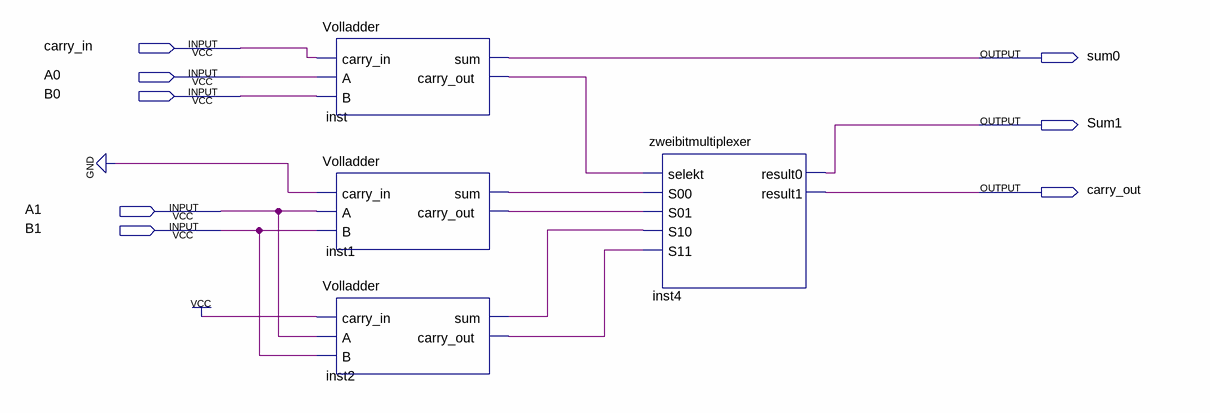
[diagram p0: schematic sheet]
// Quartus schematic conditionalSum.bdf as structural Verilog: 4 symbols, 8 pins
module conditionalSum (
  input  carry_in,
  input  A0,
  input  B0,
  input  A1,
  input  B1,
  output sum0,
  output Sum1,
  output carry_out
);

  wire inst1_carry_out, inst1_sum, inst2_carry_out, inst2_sum, inst_carry_out;

  Volladder inst (.carry_in(carry_in), .A(A0), .B(B0), .sum(sum0), .carry_out(inst_carry_out));
  Volladder inst1 (.carry_in(1'b0), .A(A1), .B(B1), .sum(inst1_sum), .carry_out(inst1_carry_out));
  Volladder inst2 (.carry_in(1'b1), .A(A1), .B(B1), .sum(inst2_sum), .carry_out(inst2_carry_out));
  zweibitmultiplexer inst4 (
    .selekt(inst_carry_out), .S00(inst1_sum), .S01(inst1_carry_out), .S10(inst2_sum), .S11(inst2_carry_out),
    .result0(Sum1), .result1(carry_out));
endmodule
